# EAGLE schematic 527_faboblocks (EAGLE 9.6.2)
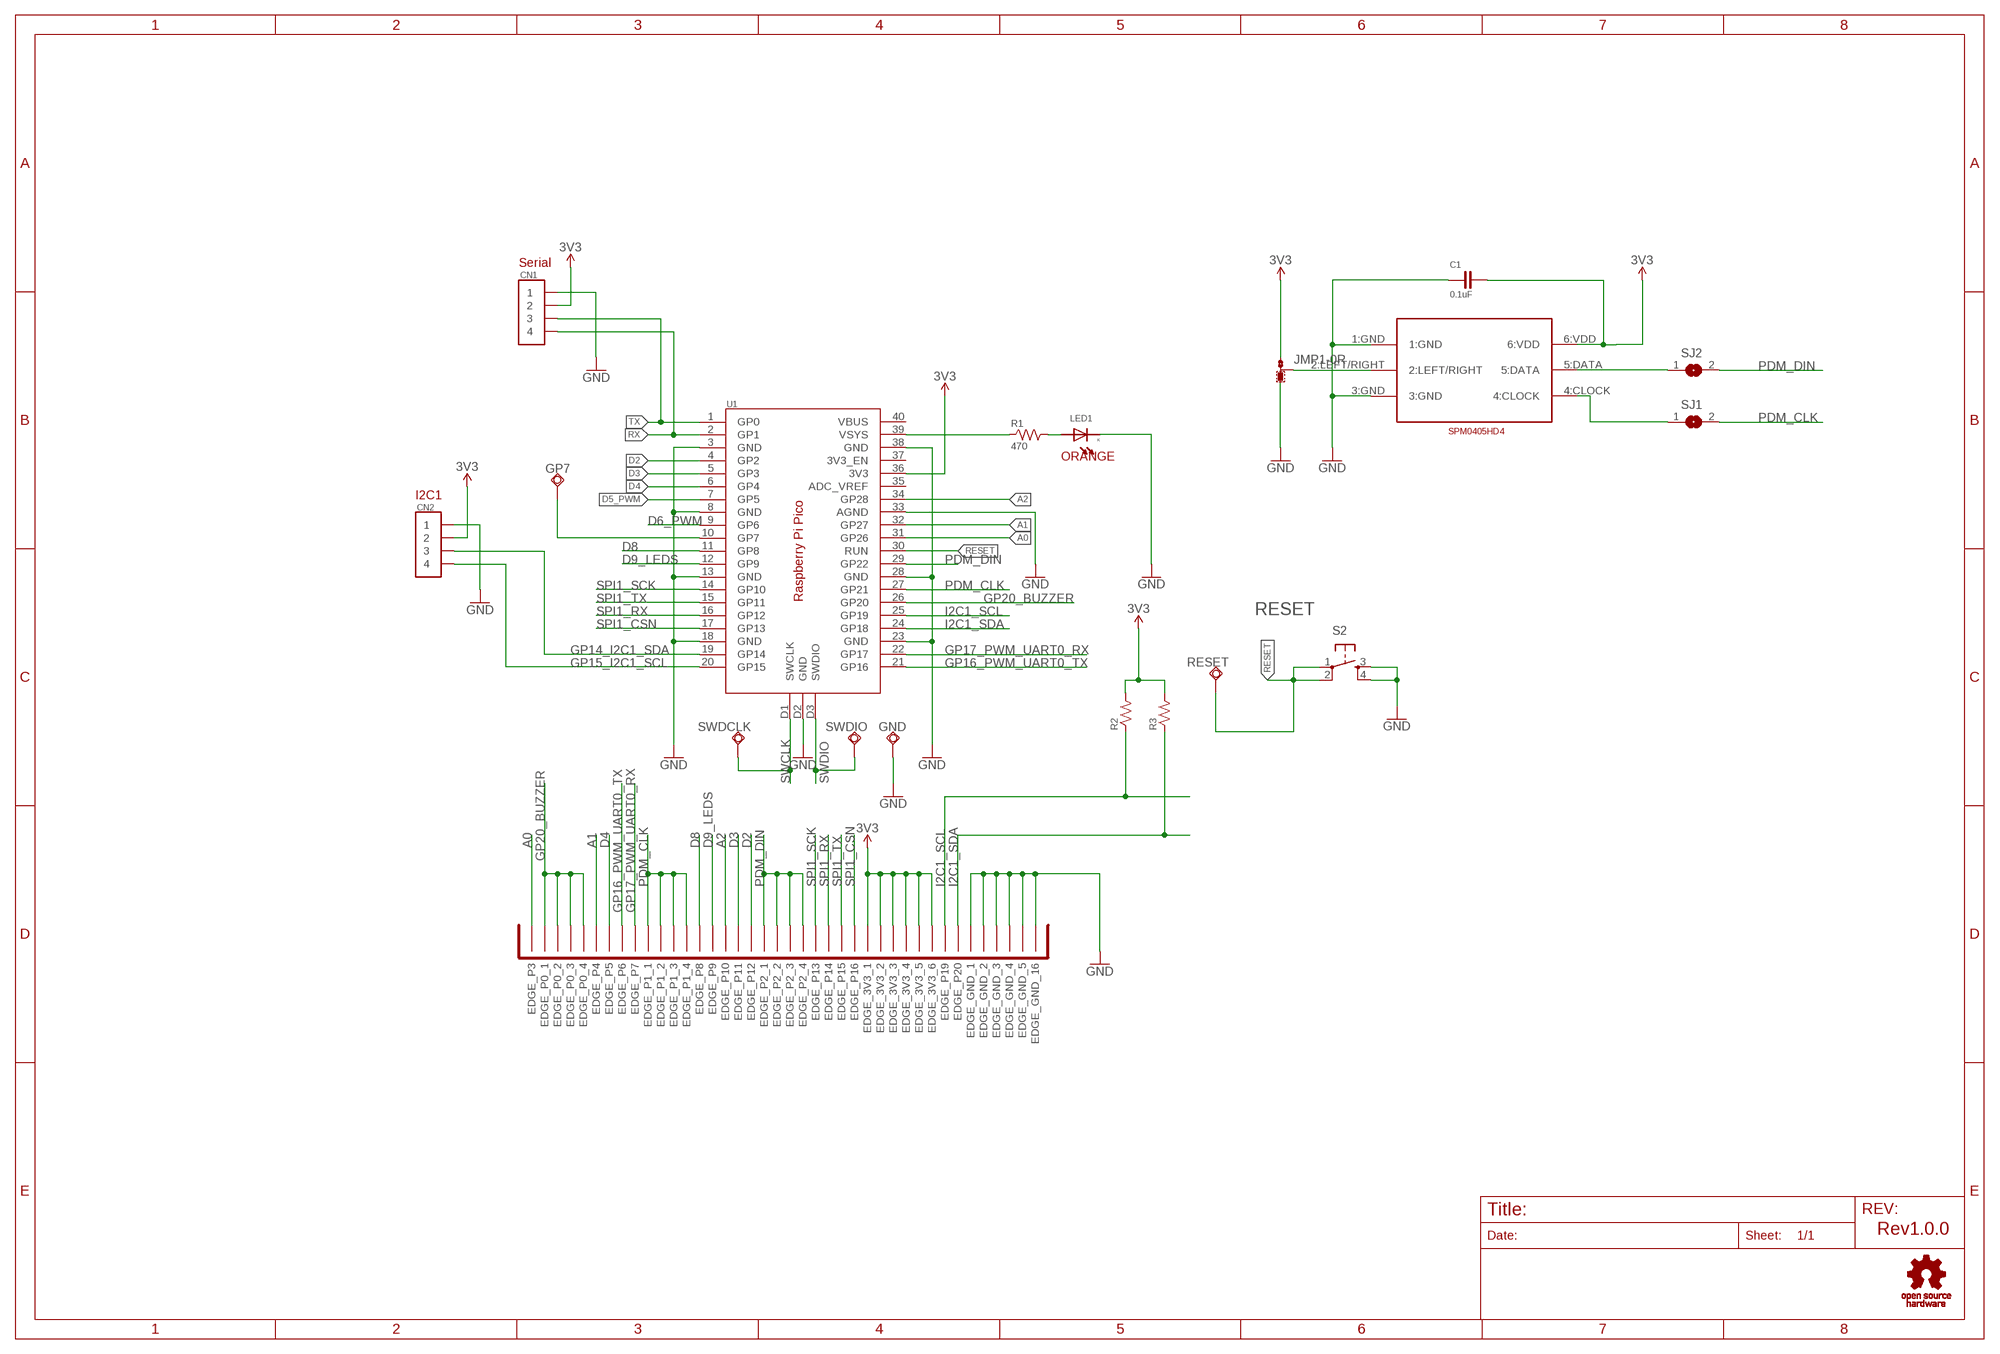
[diagram p0: schematic, sheet 1]

## Parts
C1  0.1uF  CAPACITOR-0402  [0402]
CN1  SMD-CONN-4PIN-SM04B-PASS  [SM04B-PASS]
CN2  SMD-CONN-4PIN-SM04B-PASS  [SM04B-PASS]
GND  TPSQTP20R  [TP20R]
GP7  TPSQTP20R  [TP20R]
JMP1  0R-JUMPA  [A0R-JMP]
LED1  LED-0603  [0603]
LOGO1  LOGO_OSHW-M_BOTTOM  [LOGO_OSHW_M_BOTTOM]
R1  470  RESISTOR-0603  [0603]
R2  RESISTOR-0603  [0603]
R3  RESISTOR-0603  [0603]
RESET  TPSQTP20R  [TP20R]
S2  TACT-SWITCH-SMD_KMR2  [KMR2]
SJ1  SJW  [SJW]
SJ2  SJW  [SJW]
SWDCLK  TPSQTP20R  [TP20R]
SWDIO  TPSQTP20R  [TP20R]
U1  RASPBERRY_PI_PICO  [RASPBERRY_PI_PICO_SMD]
U$1  SPM0405H  [SPM4050]
U$2  BBC_EDGE  [BBC_EDGE]

## Nets
3V3: C1.2 CN1.2 CN2.2 JMP1.1 R2.2 R3.2 U1.36(3V3) U$1.6:VDD U$2.P$27(EDGE_3V3_1) U$2.P$28(EDGE_3V3_2) U$2.P$29(EDGE_3V3_3) U$2.P$30(EDGE_3V3_4) U$2.P$31(EDGE_3V3_5) U$2.P$32(EDGE_3V3_6) U$2.P$67(EDGE_3V3_1) U$2.P$68(EDGE_3V3_2) U$2.P$69(EDGE_3V3_3) U$2.P$70(EDGE_3V3_4) U$2.P$71(EDGE_3V3_5) U$2.P$72(EDGE_3V3_6)
A0: U1.31(GP26) U$2.P$1(EDGE_P3) U$2.P$41(EDGE_P3)
A1: U1.32(GP27) U$2.P$6(EDGE_P4) U$2.P$46(EDGE_P4)
A2: U1.34(GP28) U$2.P$16(EDGE_P10) U$2.P$56(EDGE_P10)
D2: U1.4(GP2) U$2.P$18(EDGE_P12) U$2.P$58(EDGE_P12)
D3: U1.5(GP3) U$2.P$17(EDGE_P11) U$2.P$57(EDGE_P11)
D4: U1.6(GP4) U$2.P$7(EDGE_P5) U$2.P$47(EDGE_P5)
D5_PWM: U1.7(GP5)
D6_PWM: U1.9(GP6)
D8: U1.11(GP8) U$2.P$14(EDGE_P8) U$2.P$54(EDGE_P8)
D9_LEDS: U1.12(GP9) U$2.P$15(EDGE_P9) U$2.P$55(EDGE_P9)
GND: C1.1 CN1.1 CN2.1 GND.TP JMP1.3 LED1.CATHODE S2.3 S2.4 U1.3(GND) U1.8(GND) U1.13(GND) U1.18(GND) U1.23(GND) U1.28(GND) U1.33(AGND) U1.38(GND) U1.D2(GND) U$1.1:GND U$1.3:GND U$2.P$35(EDGE_GND_1) U$2.P$36(EDGE_GND_2) U$2.P$37(EDGE_GND_3) U$2.P$38(EDGE_GND_4) U$2.P$39(EDGE_GND_5) U$2.P$40(EDGE_GND_16) U$2.P$75(EDGE_GND_1) U$2.P$76(EDGE_GND_2) U$2.P$77(EDGE_GND_3) U$2.P$78(EDGE_GND_4) U$2.P$79(EDGE_GND_5) U$2.P$80(EDGE_GND_16)
GP14_I2C1_SDA: CN2.3 U1.19(GP14)
GP15_I2C1_SCL: CN2.4 U1.20(GP15)
GP16_PWM_UART0_TX: U1.21(GP16) U$2.P$8(EDGE_P6) U$2.P$48(EDGE_P6)
GP17_PWM_UART0_RX: U1.22(GP17) U$2.P$9(EDGE_P7) U$2.P$49(EDGE_P7)
GP20_BUZZER: U1.26(GP20) U$2.P$2(EDGE_P0_1) U$2.P$3(EDGE_P0_2) U$2.P$4(EDGE_P0_3) U$2.P$5(EDGE_P0_4) U$2.P$42(EDGE_P0_1) U$2.P$43(EDGE_P0_2) U$2.P$44(EDGE_P0_3) U$2.P$45(EDGE_P0_4)
I2C1_SCL: R2.1 U1.25(GP19) U$2.P$33(EDGE_P19) U$2.P$73(EDGE_P19)
I2C1_SDA: R3.1 U1.24(GP18) U$2.P$34(EDGE_P20) U$2.P$74(EDGE_P20)
N$1: R1.1 U1.39(VSYS)
N$2: LED1.ANODE R1.2
N$3: GP7.TP U1.10(GP7)
N$5: JMP1.2 U$1.2:LEFT/RIGHT
N$6: SJ1.1 U$1.4:CLOCK
N$7: SJ2.1 U$1.5:DATA
PDM_CLK: SJ1.2 U1.27(GP21) U$2.P$10(EDGE_P1_1) U$2.P$11(EDGE_P1_2) U$2.P$12(EDGE_P1_3) U$2.P$13(EDGE_P1_4) U$2.P$50(EDGE_P1_1) U$2.P$51(EDGE_P1_2) U$2.P$52(EDGE_P1_3) U$2.P$53(EDGE_P1_4)
PDM_DIN: SJ2.2 U1.29(GP22) U$2.P$19(EDGE_P2_1) U$2.P$20(EDGE_P2_2) U$2.P$21(EDGE_P2_3) U$2.P$22(EDGE_P2_4) U$2.P$59(EDGE_P2_1) U$2.P$60(EDGE_P2_2) U$2.P$61(EDGE_P2_3) U$2.P$62(EDGE_P2_4)
RESET: RESET.TP S2.1 S2.2 U1.30(RUN)
RX: CN1.4 U1.2(GP1)
SPI1_CSN: U1.17(GP13) U$2.P$26(EDGE_P16) U$2.P$66(EDGE_P16)
SPI1_RX: U1.16(GP12) U$2.P$24(EDGE_P14) U$2.P$64(EDGE_P14)
SPI1_SCK: U1.14(GP10) U$2.P$23(EDGE_P13) U$2.P$63(EDGE_P13)
SPI1_TX: U1.15(GP11) U$2.P$25(EDGE_P15) U$2.P$65(EDGE_P15)
SWCLK: SWDCLK.TP U1.D1(SWCLK)
SWDIO: SWDIO.TP U1.D3(SWDIO)
TX: CN1.3 U1.1(GP0)
Unconnected: U1.35(ADC_VREF) U1.37(3V3_EN) U1.40(VBUS)

## Notes on the sheet
- Serial
- ORANGE
- I2C1
- RESET
- Rev1.0.0

## Library data of the parts
C1 = FaBo-Capacitor:CAPACITOR: CAPACITOR
CN1 CN2 = FaBo-Connetor:SMD-CONN-4PIN
GND GP7 RESET SWDCLK SWDIO = testpad:TPSQ: Test pad
JMP1 = jump-0r-smd:0R-JUMP: SMD 0R 0805 Jumper
LED1 = FaBo-LED:LED
LOGO1 = FaBo-Logo:LOGO_OSHW
R1-R3 = FaBo-Resistors:RESISTOR: RESISTOR
S2 = FaBo-Switch:TACT-SWITCH: Part No Maker Datasheet Distributor 1273HA-160G-G SWITRONIC Catalog <http://www.switronic.com/uploads/images/A10.gif> Akizuki <http://akizukidenshi.com/catalog/g/gP-02561/> DTS-6-V Cosland DTS 6 Series <http://www.cosland.com/newproduct/DTS%20SERIES.pdf> Akizuki <http://akizukidenshi.com/catalog/g/gP-03647/> KMR2 C&K KMR2 SERIES <https://www.ckswitches.com/products/switches/product-details/Tactile/KMR2/> Octoparts Result <https://octopart.com/search?q=KMR2&start=0> TSHA-T-XB2-19E TOP UP INDUSTORY TSHA-T <http://www.top-up.com.tw/front/bin/ptdetail.phtml?Part=TSHA-T> Akizuki <http://akizukidenshi.com/catalog/g/gP-09361/>
SJ1 SJ2 = jumper:SJ: SMD solder JUMPER
U1 = FaBo-Boards:RASPBERRY_PI_PICO
U$1 = FaBo-Sensor:SPM0405H
U$2 = microbit:BBC_EDGE